# Altium schematic sheet MCU.SchDoc
size A3; SheetNumber: 2; SheetTotal: 3
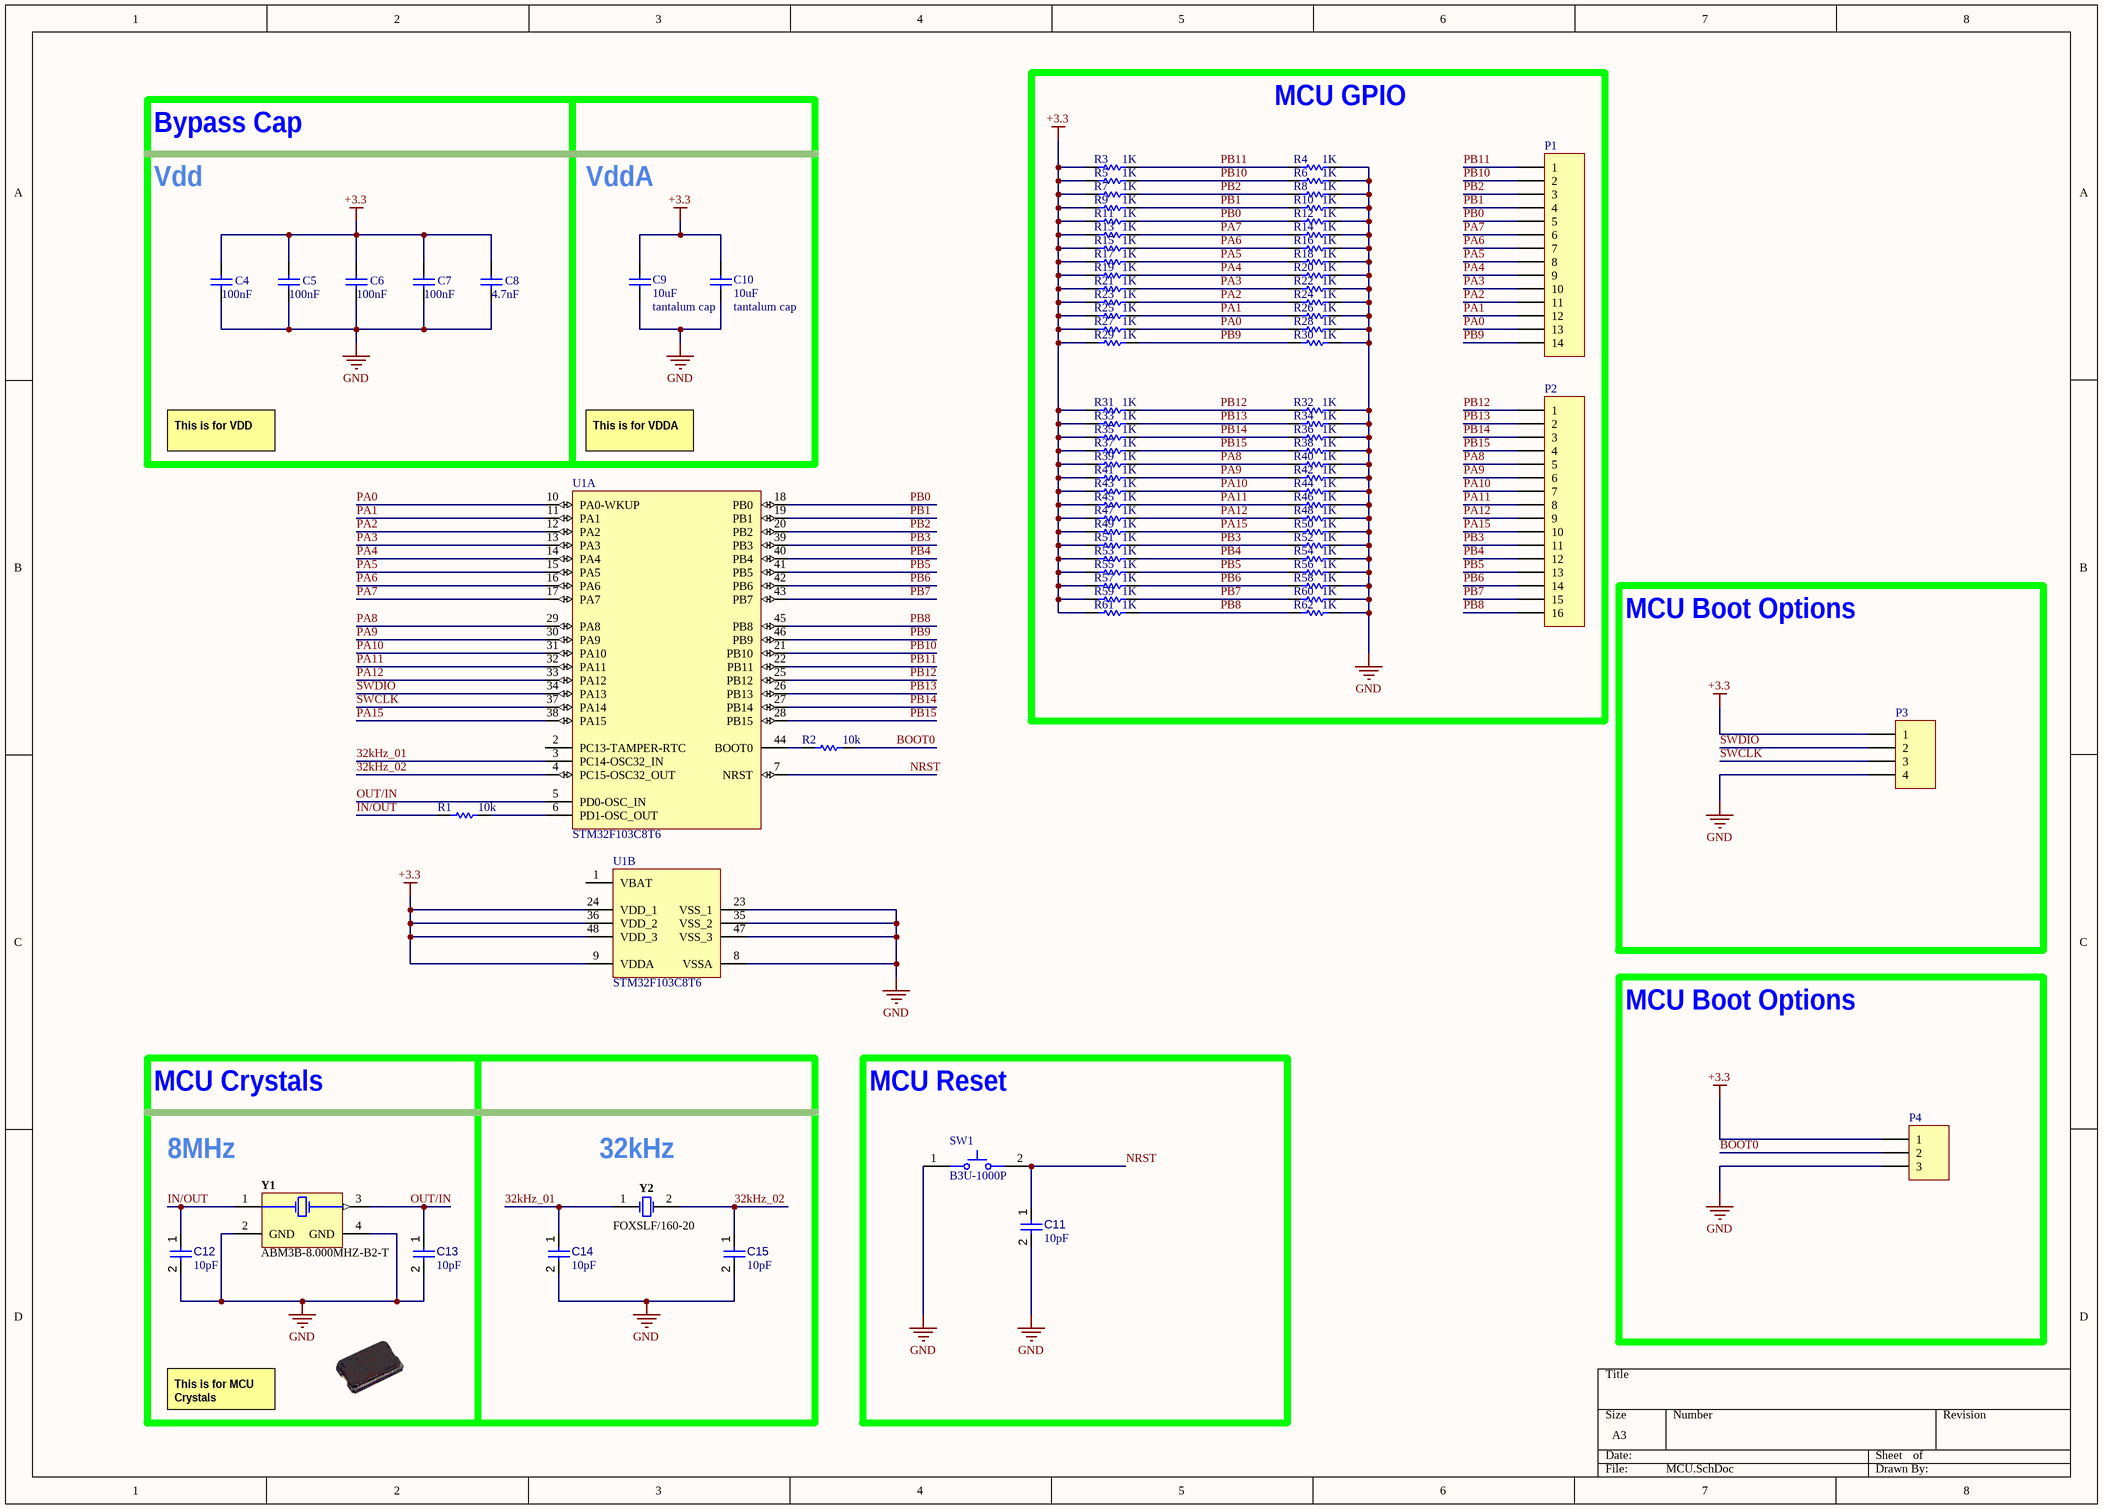
[diagram p0: MCU.SchDoc]

## Parts
C4  value 100nF  [1608[0603]cap]  (hidden comment: Cap Semi_1)
C5  value 100nF  [CAPC2013X135X45NL10T25]  (hidden comment: Capacitor 1 uF +/- 10% 50 V 0805)
C6  value 100nF  [CAPC2013X135X45NL10T25]  (hidden comment: Capacitor 1 uF +/- 10% 50 V 0805)
C7  value 100nF  [CAPC2013X135X45NL10T25]  (hidden comment: Capacitor 1 uF +/- 10% 50 V 0805)
C8  value 4.7nF  [CAPC2013X135X45NL10T25]  (hidden comment: Capacitor 1 uF +/- 10% 50 V 0805)
C9  tantalum cap  value 10uF  [C1206tancap]
C10  tantalum cap  value 10uF  [C1206tancap]
C11  value 10pF  [CAPC1005X55X25ML05T05]  (hidden comment: Capacitor 10 pF +/- 5% 50 V 0402)
C12  value 10pF  [CAPC1005X55X25ML05T05]  (hidden comment: Capacitor 10 pF +/- 5% 50 V 0402)
C13  value 10pF  [CAPC1005X55X25ML05T05]  (hidden comment: Capacitor 10 pF +/- 5% 50 V 0402)
C14  value 10pF  [CAPC1005X55X25ML05T05]  (hidden comment: Capacitor 10 pF +/- 5% 50 V 0402)
C15  value 10pF  [CAPC1005X55X25ML05T05]  (hidden comment: Capacitor 10 pF +/- 5% 50 V 0402)
P1  Header 14  [My_1X14]  (value not drawn)
P2  Header 16  [MY_FE16]  (value not drawn)
P3  Header 4  [My_1X04]  (value not drawn)
P4  Header 3  [My_1X03]  (value not drawn)
R1  10k  [MY_0603]
R2  10k  [MY_0603]
R3  1K  [MY_0603]
R4  1K  [MY_0603]
R5  1K  [MY_0603]
R6  1K  [MY_0603]
R7  1K  [MY_0603]
R8  1K  [MY_0603]
R9  1K  [MY_0603]
R10  1K  [MY_0603]
R11  1K  [MY_0603]
R12  1K  [MY_0603]
R13  1K  [MY_0603]
R14  1K  [MY_0603]
R15  1K  [MY_0603]
R16  1K  [MY_0603]
R17  1K  [MY_0603]
R18  1K  [MY_0603]
R19  1K  [MY_0603]
R20  1K  [MY_0603]
R21  1K  [MY_0603]
R22  1K  [MY_0603]
R23  1K  [MY_0603]
R24  1K  [MY_0603]
R25  1K  [MY_0603]
R26  1K  [MY_0603]
R27  1K  [MY_0603]
R28  1K  [MY_0603]
R29  1K  [MY_0603]
R30  1K  [MY_0603]
R31  1K  [MY_0603]
R32  1K  [MY_0603]
R33  1K  [MY_0603]
R34  1K  [MY_0603]
R35  1K  [MY_0603]
R36  1K  [MY_0603]
R37  1K  [MY_0603]
R38  1K  [MY_0603]
R39  1K  [MY_0603]
R40  1K  [MY_0603]
R41  1K  [MY_0603]
R42  1K  [MY_0603]
R43  1K  [MY_0603]
R44  1K  [MY_0603]
R45  1K  [MY_0603]
R46  1K  [MY_0603]
R47  1K  [MY_0603]
R48  1K  [MY_0603]
R49  1K  [MY_0603]
R50  1K  [MY_0603]
R51  1K  [MY_0603]
R52  1K  [MY_0603]
R53  1K  [MY_0603]
R54  1K  [MY_0603]
R55  1K  [MY_0603]
R56  1K  [MY_0603]
R57  1K  [MY_0603]
R58  1K  [MY_0603]
R59  1K  [MY_0603]
R60  1K  [MY_0603]
R61  1K  [MY_0603]
R62  1K  [MY_0603]
SW1  B3U-1000P  [OMRON-B3U-1000_V]
U1  STM32F103C8T6  [STM-LQFP48_L]  (parts A,B of 2)
Y1  ABM3B-8.000MHZ-B2-T  [ABRA-ABM3B_V]
Y2  FOXSLF/160-20  [FOX-FOXSLF160-20]

## Blocks framed on the sheet
MCU GPIO: P1 P2 R3-R62
MCU Boot Options: P3
MCU Boot Options: P4
MCU Reset: C11 SW1

## Nets
+3.3: C4.2 C5.2 C6.2 C7.2 C8.2 C9.2 C10.2 P3.1 P4.1 R3.1 R5.1 R7.1 R9.1 R11.1 R13.1 R15.1 R17.1 R19.1 R21.1 R23.1 R25.1 R27.1 R29.1 R31.1 R33.1 R35.1 R37.1 R39.1 R41.1 R43.1 R45.1 R47.1 R49.1 R51.1 R53.1 R55.1 R57.1 R59.1 R61.1 U1.9(VDDA) U1.24(VDD_1) U1.36(VDD_2) U1.48(VDD_3)
GND: C4.1 C5.1 C6.1 C7.1 C8.1 C9.1 C10.1 C11.2 C12.2 C13.2 C14.2 C15.2 P3.4 P4.3 R4.2 R6.2 R8.2 R10.2 R12.2 R14.2 R16.2 R18.2 R20.2 R22.2 R24.2 R26.2 R28.2 R30.2 R32.2 R34.2 R36.2 R38.2 R40.2 R42.2 R44.2 R46.2 R48.2 R50.2 R52.2 R54.2 R56.2 R58.2 R60.2 R62.2 SW1.1 U1.8(VSSA) U1.23(VSS_1) U1.35(VSS_2) U1.47(VSS_3) Y1.2(GND) Y1.4(GND)
32kHz_01: C14.1 U1.3(PC14-OSC32_IN) Y2.1
32kHz_02: C15.1 U1.4(PC15-OSC32_OUT) Y2.2
BOOT0: P4.2 R2.2
IN/OUT: C12.1 R1.1 Y1.1(X1)
NRST: C11.1 SW1.2 U1.7(NRST)
OUT/IN: C13.1 U1.5(PD0-OSC_IN) Y1.3(X2)
PA0: P1.13 R27.2 R28.1 U1.10(PA0-WKUP)
PA1: P1.12 R25.2 R26.1 U1.11(PA1)
PA2: P1.11 R23.2 R24.1 U1.12(PA2)
PA3: P1.10 R21.2 R22.1 U1.13(PA3)
PA4: P1.9 R19.2 R20.1 U1.14(PA4)
PA5: P1.8 R17.2 R18.1 U1.15(PA5)
PA6: P1.7 R15.2 R16.1 U1.16(PA6)
PA7: P1.6 R13.2 R14.1 U1.17(PA7)
PA8: P2.5 R39.2 R40.1 U1.29(PA8)
PA9: P2.6 R41.2 R42.1 U1.30(PA9)
PA10: P2.7 R43.2 R44.1 U1.31(PA10)
PA11: P2.8 R45.2 R46.1 U1.32(PA11)
PA12: P2.9 R47.2 R48.1 U1.33(PA12)
PA15: P2.10 R49.2 R50.1 U1.38(PA15)
PB0: P1.5 R11.2 R12.1 U1.18(PB0)
PB1: P1.4 R9.2 R10.1 U1.19(PB1)
PB2: P1.3 R7.2 R8.1 U1.20(PB2)
PB3: P2.11 R51.2 R52.1 U1.39(PB3)
PB4: P2.12 R53.2 R54.1 U1.40(PB4)
PB5: P2.13 R55.2 R56.1 U1.41(PB5)
PB6: P2.14 R57.2 R58.1 U1.42(PB6)
PB7: P2.15 R59.2 R60.1 U1.43(PB7)
PB8: P2.16 R61.2 R62.1 U1.45(PB8)
PB9: P1.14 R29.2 R30.1 U1.46(PB9)
PB10: P1.2 R5.2 R6.1 U1.21(PB10)
PB11: P1.1 R3.2 R4.1 U1.22(PB11)
PB12: P2.1 R31.2 R32.1 U1.25(PB12)
PB13: P2.2 R33.2 R34.1 U1.26(PB13)
PB14: P2.3 R35.2 R36.1 U1.27(PB14)
PB15: P2.4 R37.2 R38.1 U1.28(PB15)
SWCLK: P3.3 U1.37(PA14)
SWDIO: P3.2 U1.34(PA13)
NetR1_2: R1.2 U1.6(PD1-OSC_OUT)
NetR2_1: R2.1 U1.44(BOOT0)

Not connected (* = marked no-connect by the designer): U1 1(VBAT) 2(PC13-TAMPER-RTC)

## Notes on the sheet
- Bypass Cap
- Vdd
- VddA
- This is for VDD
- This is for VDDA
- MCU Crystals
- 8MHz
- (near Y2) 32kHz
- This is for MCU Crystals

## Library data of the parts
C4-C8 = Cap Semi_1: Capacitor (Semiconductor SIM Model); Published: 8-Jun-2000; LatestRevisionDate: 29-May-2009; LatestRevisionNote: IPC-7351 Footprint Added.; PackageReference: C1206; Publisher: Altium Limited; PackageDescription: Chip Capacitor
C9 C10 = Cap Semi_5: Capacitor (Semiconductor SIM Model); Published: 8-Jun-2000; LatestRevisionDate: 29-May-2009; LatestRevisionNote: IPC-7351 Footprint Added.; PackageReference: C1206; Publisher: Altium Limited; PackageDescription: Chip Capacitor
C11-C15 = CMP-001-00013-6: Chip Capacitor, 10 pF, +/- 5%, 50 V, 0402 (1005 Metric); Capacitor Type: Ceramic; Voltage Rating: 50V; Max Operating Temperature: 125°C; Pins: 2; Mounting Technology: SM; Tolerance: 5%; RoHS Compliant: True; Case/Package: 0402; Min Operating Temperature: -55°C
P1 = Header 14: Header, 14-Pin; ASiD Part Number: Header 14-AS
P2 = Header 16: Header, 16-Pin; ASiD Part Number: Header 16-AS
P3 = Header 4: Header, 4-Pin; ASiD Part Number: Header 4-AS
P4 = Header 3: Header, 3-Pin; ASiD Part Number: Header 3-AS
R1-R62 = Res: Standard resistor; ASiD Part Number: Res-AS
  R1 R2: Value: 10k
  R3-R62: Value: 1K
SW1 = CMP-011-00000-2: Tactile Switch, SPST-NO, 0.05 A, 12 V, -25 to 70 degC, 2-Pin SMD, RoHS, Tape and Reel; Manufacturer: Omron Electronic Components; IP Rating: IP40; Current Rating: 50mA; Max Contact Resistance: 100mohm; Operating Force: 153gf; Throw Configuration: SPST; Resistance: 0.1Ohm; Max Voltage Rating (DC): 12V; Contact Material: Silver; Max Current Rating: 50mA; Datasheet URL: http://www.omron.com/ecb/products/pdf/en-b3u.pdf; Mounting Technology: SM; Case/Package: B3U-1000; Packaging: TapeandReel; Package Reference: B3U-1000; Manufacturer URL: http://www.omron.com/; Datasheet Version: Jan-15; RoHS Compliant: True; Max Operating Temperature: 70°C; Contact Current Rating: 50mA; Package Quantity: 3500; Package Description: 2-Pin Surface Mount Device, Body 3 x 2.5 mm; Voltage Rating (DC): 12V; Min Operating Temperature: -25°C; Voltage Rating: 12V
U1 = CMP-0237-00215-3: ARM Cortex-M3 32-bit MCU, 64 KB Flash, 20 KB Internal RAM, 37 I/Os, 48-pin LQFP, -40 to 85 degC, Tray; Supply Voltage(Vcc) min (V): 2; Internal RAM Size (kB): 20; FLASH Size (Prog) (kB): 64; A/D Converter: 2x12-bit (10 Channel); I/Os (High Current): 37; Operating Frequency(F) (Processor speed) (MHz): 72; Core: ARM Cortex-M3; ComponentLink3Description: Package Specification; Mounting Technology: Surface Mount; PartNumber: STM32F103C8T6; PackageReference: LQFP48; Packing: Tray; ComponentLink3URL: http://www.st.com/st-web-ui/static/active/en/resource/technical/document/datasheet/DM00058181.pdf; DatasheetVersion: Rev. 16; ComponentLink1URL: http://www.st.com/web/en/home.html; PackageVersion: Rev. 6, 06/2013; ComponentLink2URL: http://www.st.com/st-web-ui/static/active/en/resource/technical/document/datasheet/CD00161566.pdf; ComponentLink1Description: Manufacturer URL; ComponentLink2Description: Datasheet; PackageDescription: 48-Pin Low Profile Quad Flat Package, 7 x 7 mm Body, 0.5 mm Pitch
Y1 = CMP-003-00021-2: Ceramic SMD Crystal, 8 MHz, +/- 20 ppm, 18 pF, -20 to 70 degC, 4-Pin SMD, RoHS, Tape and Reel; Manufacturer: Abracon; Resistance: 200Ohm; ESR: 200; Tolerance: 20ppm; Frequency: 8MHz; Load Capacitance: 18pF; Mounting Technology: SM; Case/Package: CSMD; Pins: 4; Datasheet Version: Aug-15; Datasheet URL: http://www.abracon.com/Resonators/abm3b.pdf; Manufacturer URL: http://www.abracon.com/; Package Quantity: 1000; Package Description: 4-Pin Surface Mount Device, Body 5 x 3.2 mm; Package Reference: ABM3B; Min Operating Temperature: -20°C; Max Operating Temperature: 70°C; Packaging: TapeandReel; Frequency Tolerance: 20ppm; RoHS Compliant: True
Y2 = CMP-003-00027-2: Resistance Weld Thru-Hole Crystal, 16 MHz, +/- 30 ppm, 20 pF, -20 to 70 degC, 2-Pin THD, RoHS, Bulk; Manufacturer: FOX Electronics; Load Capacitance: 20pF; Resistance: 40Ohm; ESR: 40; Tolerance: 50ppm; Frequency Tolerance: 30ppm; Frequency: 16MHz; Datasheet URL: http://www.foxonline.com/pdfs/hc49slf.pdf; Packaging: Bulk; Min Operating Temperature: -20°C; Max Operating Temperature: 70°C; Mounting Technology: TH; RoHS Compliant: True; Datasheet Version: Mar-15; Manufacturer URL: http://www.foxonline.com/; Package Description: 2-Pin Through Hole Device, Body 11.35 x 4.65 mm; Pins: 2; Package Quantity: 100; Case/Package: FOXSLF160-20; Package Reference: FOXSLF160-20